# EAGLE design H_BRIDGE (EAGLE 5.06)
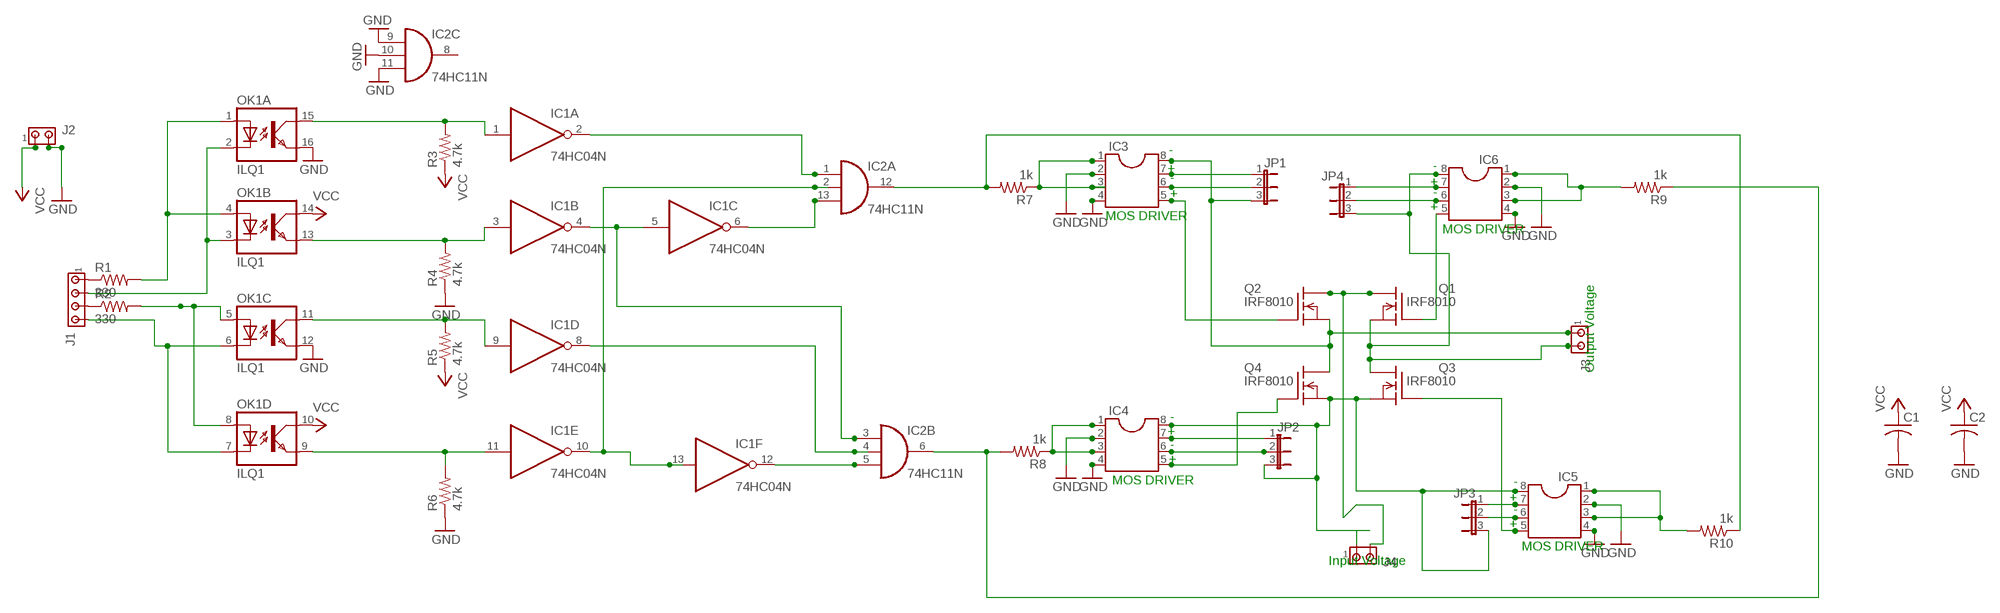
[diagram p0: schematic, sheet 1]

## Parts
C1  C-US025-030X050  [C025-030X050]
C2  C-US025-030X050  [C025-030X050]
IC1  74HC04N  [DIL14]
IC2  74HC11N  [DIL14]
IC3  DIL8  [DIL08]
IC4  DIL8  [DIL08]
IC5  DIL8  [DIL08]
IC6  DIL8  [DIL08]
J1  MTA04-100  [10X04MTA]
J2  MTA02-156  [1X2MTA]
J3  MTA02-156  [1X2MTA]
J4  MTA02-156  [1X2MTA]
JP1  JP2E  [JP2]
JP2  JP2E  [JP2]
JP3  JP2E  [JP2]
JP4  JP2E  [JP2]
OK1  ILQ1  [DIL16]
Q1  IRF8010  IRF840  [TO220]
Q2  IRF8010  IRF840  [TO220]
Q3  IRF8010  IRF840  [TO220]
Q4  IRF8010  IRF840  [TO220]
R1  330  R-US_0204/7  [0204/7]
R2  330  R-US_0204/7  [0204/7]
R3  4.7k  R-US_0204/7  [0204/7]
R4  4.7k  R-US_0204/7  [0204/7]
R5  4.7k  R-US_0204/7  [0204/7]
R6  4.7k  R-US_0204/7  [0204/7]
R7  1k  R-US_0204/7  [0204/7]
R8  1k  R-US_0204/7  [0204/7]
R9  1k  R-US_0204/7  [0204/7]
R10  1k  R-US_0204/7  [0204/7]

## Nets
GND: C1.2 C2.2 IC2.9(C:I0) IC2.10(C:I1) IC2.11(C:I2) IC3.2 IC3.4 IC4.2 IC4.4 IC5.2 IC5.4 IC6.2 IC6.4 J2.2 OK1.12(C:EMIT) OK1.16(A:EMIT) R4.1 R6.1
N$1: J1.1 R1.1
N$2: J1.3 R2.1
N$3: OK1.1(A:A) OK1.4(B:A) R1.2
N$4: J1.2 OK1.2(A:C) OK1.3(B:C)
N$5: OK1.5(C:A) OK1.8(D:A) R2.2
N$6: J1.4 OK1.6(C:C) OK1.7(D:C)
N$7: IC1.1(A:I) OK1.15(A:COL) R3.2
N$8: IC1.3(B:I) OK1.13(B:EMIT) R4.2
N$9: IC1.9(D:I) OK1.11(C:COL) R5.2
N$10: IC1.11(E:I) OK1.9(D:EMIT) R6.2
N$11: IC1.4(B:O) IC1.5(C:I) IC2.3(B:I0)
N$12: IC1.10(E:O) IC1.13(F:I) IC2.2(A:I1)
N$13: IC1.2(A:O) IC2.1(A:I0)
N$14: IC1.6(C:O) IC2.13(A:I2)
N$15: IC1.8(D:O) IC2.4(B:I1)
N$16: IC1.12(F:O) IC2.5(B:I2)
N$17: IC2.12(A:O) R7.2 R10.1
N$18: IC2.6(B:O) R8.2 R9.1
N$19: IC3.1 IC3.3 R7.1
N$20: IC5.1 IC5.3 R10.2
N$21: IC6.1 IC6.3 R9.2
N$22: IC4.1 IC4.3 R8.1
N$23: IC4.5 Q4.1(G)
N$24: IC5.5 Q3.1(G)
N$26: IC3.5 Q2.1(G)
N$27: IC4.6 JP2.2
N$28: IC4.7 JP2.1
N$29: IC3.6 JP1.2
N$30: IC3.7 JP1.1
N$31: IC6.6 JP4.2
N$32: IC6.7 JP4.1
N$33: IC5.6 JP3.2
N$34: IC5.7 JP3.1
N$35: IC4.8 IC5.8 J4.1 JP2.3 JP3.3 Q3.3(S) Q4.3(S)
N$36: IC6.8 J3.2 JP4.3 Q1.3(S) Q3.2(D)
N$39: J4.2 Q1.2(D) Q2.2(D)
N$40: IC3.8 J3.1 JP1.3 Q2.3(S) Q4.2(D)
N$42: IC6.5 Q1.1(G)
VCC: C1.1 C2.1 J2.1 OK1.10(D:COL) OK1.14(B:COL) R3.1 R5.1
Unconnected: IC2.8(C:O)

## Notes on the sheet
- -
- + | -
- -
- +
- + | -
- +
- MOS DRIVER
- MOS DRIVER
- Output Voltage
- -
- +
- -
- +
- MOS DRIVER | -
- +
- -
- +
- MOS DRIVER
- Input Voltage

## Power pins joined to a net without a drawn wire
GND: IC1.7(P:GND) IC2.7(P:GND)
VCC: IC1.14(P:VCC) IC2.14(P:VCC)

## Library data of the parts
C1 C2 = rcl:C-US: CAPACITOR, American symbol
IC1 = 74xx-eu:74*04: Hex INVERTER
IC2 = 74xx-eu:74*11: Triple 3-input AND gate
IC3-IC6 = ic-package:DIL8: Dual In Line / Socket
J1 = con-amp:MTA04-100: AMP connector
J2-J4 = con-amp:MTA02-156: AMP connector
JP1-JP4 = jumper:JP2E: JUMPER
OK1 = optocoupler:ILQ1: SIEMENS OPTO COUPLER
Q1-Q4 = transistor-fet:IRF840: N-Channel Enhancement MOSFET (HEXFET); 500V; 8A; 0,85Ohm
R1-R10 = rcl:R-US_: RESISTOR, American symbol

## Board
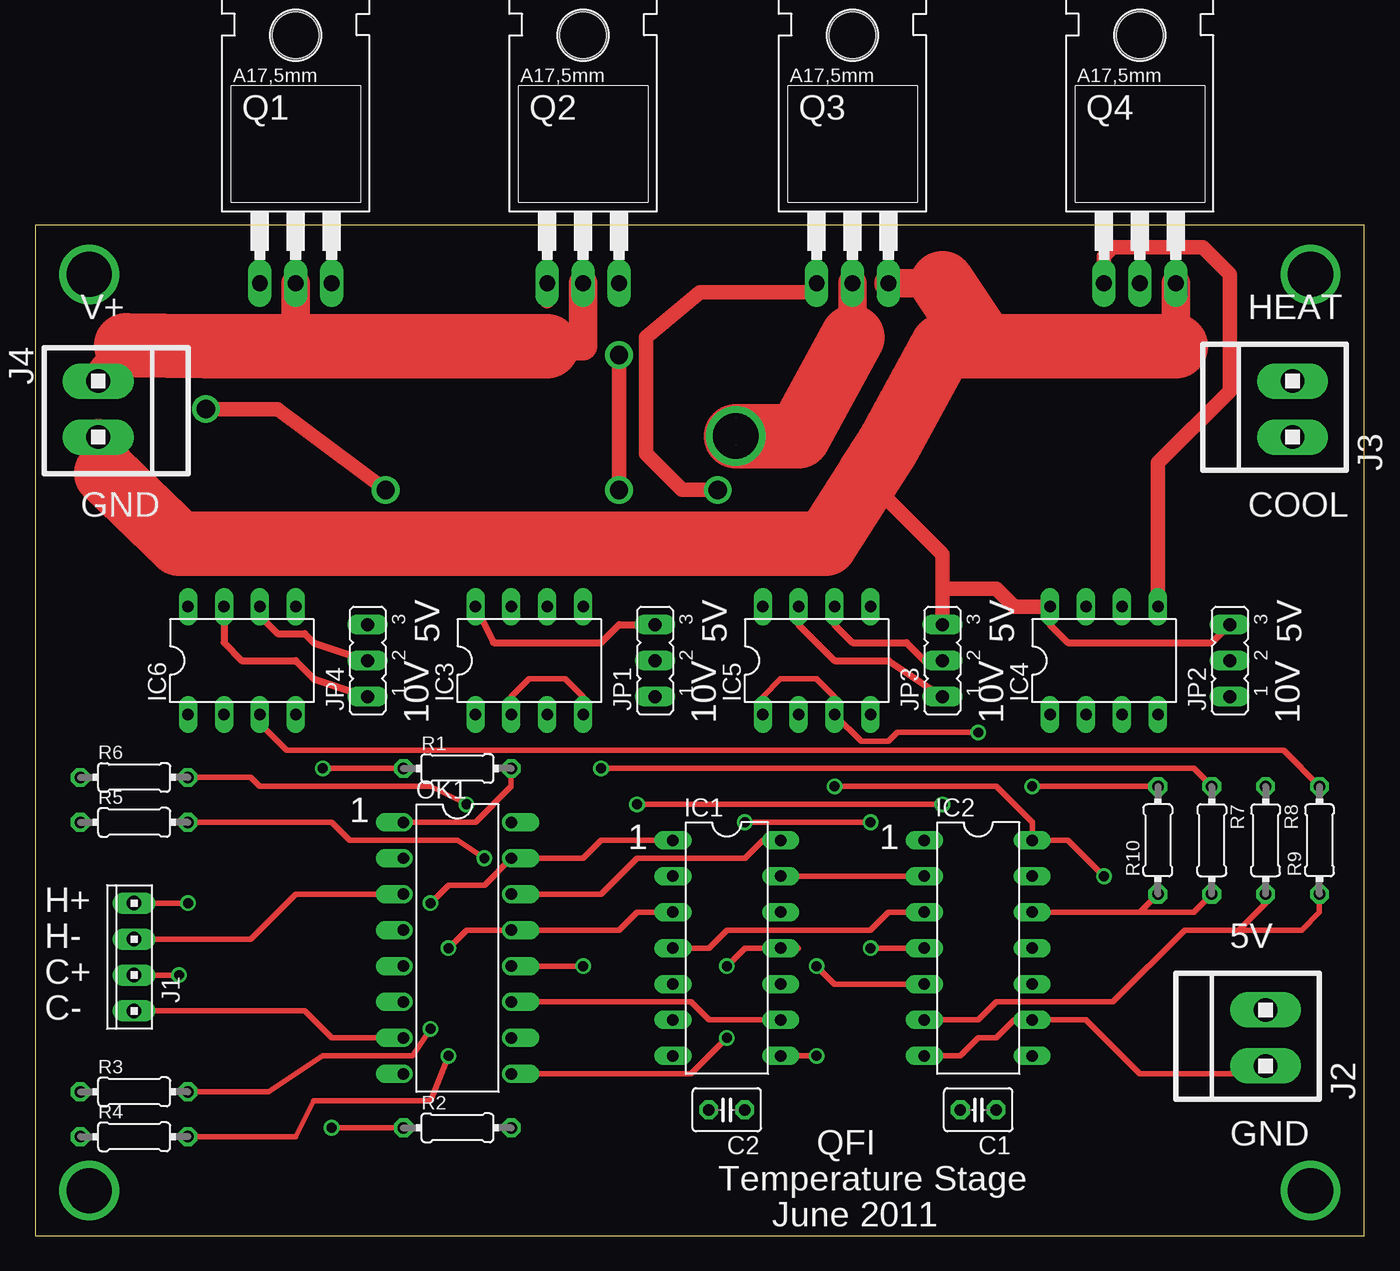
[diagram p1: board, top side]
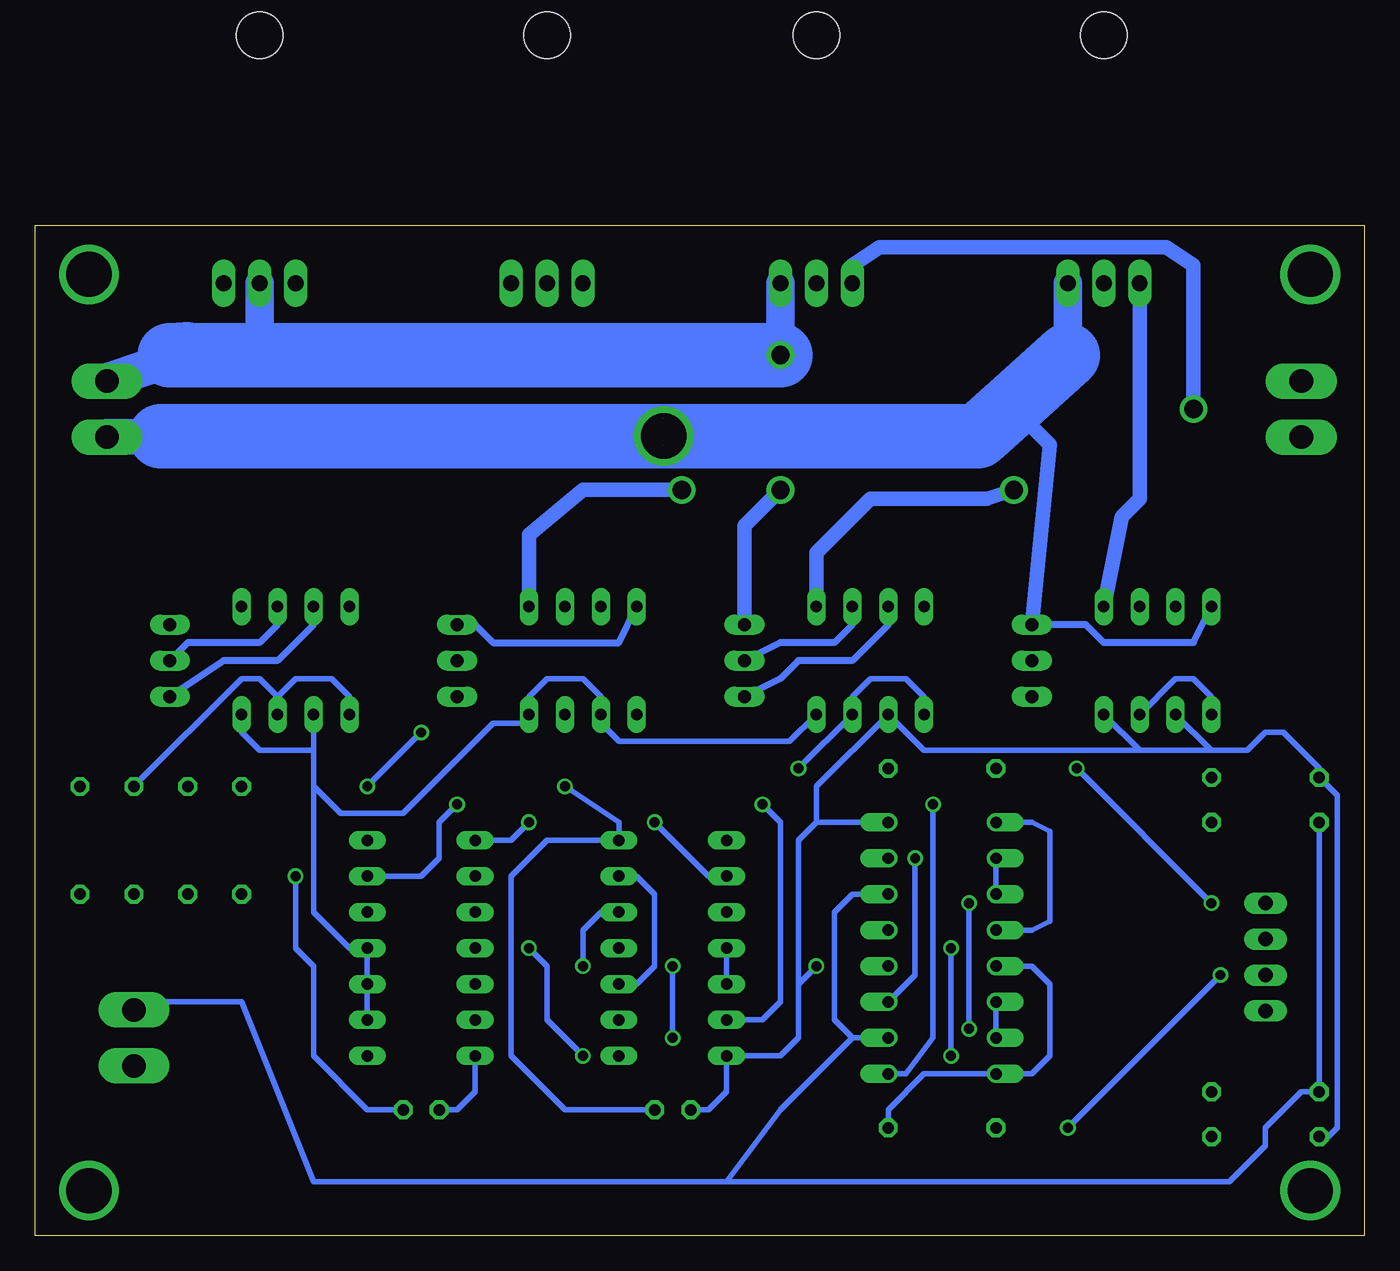
[diagram p2: board, bottom side, seen from below]

Size 93.96 x 71.42 mm. Coordinates in mm from the lower left corner, seen from the top.
Outline: 0,0 93.96,0 93.96,71.42 0,71.42 0,0
Copper layers (1*16): Top 0.035mm / dielectric 1.5mm / Bottom 0.035mm
Design rules "default": minimum track width 10mil, minimum drill 24mil, track to track 8mil, track to pad 8mil, pad to pad 8mil, via to via 8mil, smd to smd 8mil, copper to edge 40mil, drill to drill 8mil, minimum pad ring 10mil, minimum via ring 8mil, stop-mask expansion 4mil, vias tented up to drill 0mil, thermal gap 10mil

### Footprints (pad centres in the part's own frame; a part is rotated, then mirrored left to right if it is on the bottom)
C025-030X050 = drill 0.813 octagon: 1 -1.27,0; 2 1.27,0
DIL14 = drill 0.813 long: 1 -7.62,-3.81; 2 -5.08,-3.81; 3 -2.54,-3.81; 4 0,-3.81; 5 2.54,-3.81; 6 5.08,-3.81; 7 7.62,-3.81; 8 7.62,3.81; 9 5.08,3.81; 10 2.54,3.81; 11 0,3.81; 12 -2.54,3.81; 13 -5.08,3.81; 14 -7.62,3.81
DIL08 = drill 0.813 long: 1 -3.81,-3.81; 2 -1.27,-3.81; 3 1.27,-3.81; 4 3.81,-3.81; 5 3.81,3.81; 6 1.27,3.81; 7 -1.27,3.81; 8 -3.81,3.81
10X04MTA = drill 1.016 long: 1 3.81,0; 2 1.27,0; 3 -1.27,0; 4 -3.81,0
1X2MTA = drill 1.676 long: 1 1.981,0; 2 -1.981,0
JP2 = drill 0.914 long: 1 -2.54,0; 2 0,0; 3 2.54,0
DIL16 = drill 0.813 offset: 1 -8.89,-3.81; 2 -6.35,-3.81; 3 -3.81,-3.81; 4 -1.27,-3.81; 5 1.27,-3.81; 6 3.81,-3.81; 7 6.35,-3.81; 8 8.89,-3.81; 9 8.89,3.81; 10 6.35,3.81; 11 3.81,3.81; 12 1.27,3.81; 13 -1.27,3.81; 14 -3.81,3.81; 15 -6.35,3.81; 16 -8.89,3.81
TO220 = drill 1.118 long: 1 -2.54,-6.35; 2 0,-6.35; 3 2.54,-6.35 | hole 3.302: 0,11.176
0204/7 = drill 0.813 octagon: 1 -3.81,0; 2 3.81,0

### Placement (x,y rotation side)
C1  66.67,8.89 180 top
C2  48.9,8.89 180 top
IC1  48.9,20.32 270 top
IC2  66.67,20.32 270 top
IC3  34.93,40.64 0 top
IC4  75.56,40.64 0 top
IC5  55.25,40.64 0 top
IC6  14.61,40.64 0 top
J1  6.99,19.69 90 top
J2  86.99,13.97 90 top
J3  88.9,58.42 90 top
J4  4.45,58.42 270 top
JP1  43.82,40.64 90 top
JP2  84.45,40.64 90 top
JP3  64.13,40.64 90 top
JP4  23.49,40.64 90 top
OK1  29.84,20.32 270 top
Q1  18.41,73.66 0 top
Q2  38.73,73.66 0 top
Q3  57.79,73.66 0 top
Q4  78.1,73.66 0 top
R1  29.84,33.02 0 top
R2  29.84,7.62 0 top
R3  6.99,10.16 0 top
R4  6.99,6.98 0 top
R5  6.99,29.21 0 top
R6  6.99,32.39 0 top
R7  83.18,27.94 270 top
R8  86.99,27.94 270 top
R9  90.8,27.94 90 top
R10  79.38,27.94 90 top

### Tracks (layer width: path | path; a pad name or v marks a point on that pad's centre or on a via)
GND  (via drill 0.7)
  Top 0.406: v38.73,19.05 OK1.12 | IC2.7 65.41,12.7 66.67,13.97 67.94,13.97 69.21,15.24 IC2.9 74.3,15.24 78.1,11.43 86.44,11.43 J2.2 | IC3.4 38.73,38.1 37.47,39.37 34.93,39.37 33.66,38.1 IC3.2
  Bottom 0.406: R4.1 2.54,6.98 1.91,7.62 1.91,31.12 R6.1 3.17,33.02 5.71,35.56 6.99,35.56 8.26,34.29 10.79,34.29 | 40.01,17.78 v38.73,19.05 | 40.01,17.78 40.01,13.97 41.27,12.7 IC1.7 45.09,10.16 46.36,8.89 C2.2 | IC2.9 IC2.10 IC2.11 71.75,20.32 74.3,22.86 74.3,31.75 | 38.73,29.21 OK1.16 | 38.73,29.21 40.01,27.94 40.01,17.78 | 10.79,34.29 IC6.2 | 15.88,34.29 IC6.4 | 10.79,34.29 15.88,34.29 | 38.73,29.21 38.73,31.75 IC3.2 31.11,34.29 15.88,34.29 | IC3.4 40.64,34.93 52.71,34.93 53.98,36.2 IC5.2 53.98,38.1 55.25,39.37 57.79,39.37 59.05,38.1 IC5.4 59.69,36.2 61.59,36.2 67.94,29.84 72.39,29.84 74.3,31.75 | 74.3,31.75 74.3,34.29 | 74.3,34.29 IC4.2 | IC4.4 79.38,35.56 78.1,34.29 74.3,34.29 | C1.2 64.13,8.89 62.87,10.16 IC2.7
N$1  (via drill 0.7)
  Top 0.406: J1.1 v10.79,23.49 | v20.32,33.02 R1.1
  Bottom 0.406: v10.79,23.49 v20.32,33.02
N$2  (via drill 0.7)
  Top 0.406: J1.3 v10.16,18.41 | v20.95,7.62 R2.1
  Bottom 0.406: v10.16,18.41 v20.95,7.62
N$3
  Top 0.406: R1.2 33.66,31.75 31.11,29.21 OK1.1
  Bottom 0.406: OK1.1 23.49,29.21 22.22,28.58 22.22,22.23 23.49,21.59 OK1.4
N$4
  Top 0.406: J1.2 15.24,20.95 18.41,24.13 OK1.3
  Bottom 0.406: OK1.3 OK1.2
N$5
  Bottom 0.406: R2.2 33.66,8.89 31.11,11.43 OK1.8 23.49,11.43 22.22,12.7 22.22,17.78 23.49,19.05 OK1.5
N$6
  Top 0.406: J1.4 19.05,15.87 20.95,13.97 OK1.7
  Bottom 0.406: OK1.7 OK1.6
N$7  (via drill 0.7)
  Top 0.406: R3.2 16.51,10.16 20.32,12.7 26.67,12.7 v27.94,14.6 | v27.94,23.49 29.21,24.77 31.75,24.77 OK1.15 38.73,26.67 40.01,27.94 IC1.1
  Bottom 0.406: v27.94,14.6 v27.94,23.49
N$8  (via drill 0.7)
  Top 0.406: R4.2 18.41,6.98 19.68,9.53 27.94,9.53 v29.21,12.7 | v29.21,20.32 30.48,21.59 OK1.13 41.27,21.59 42.55,22.86 IC1.3
  Bottom 0.406: v29.21,12.7 v29.21,20.32
N$9  (via drill 0.7)
  Top 0.406: R5.2 20.95,29.21 22.22,27.94 29.84,27.94 v31.75,26.67 | 34.93,16.51 OK1.11 46.36,16.51 47.62,15.24 IC1.9
  Bottom 0.406: v31.75,26.67 31.75,18.41 OK1.11
N$10  (via drill 0.7)
  Top 0.406: R6.2 15.24,32.39 15.88,31.75 27.94,31.75 v30.48,30.48 | 34.93,11.43 OK1.9 46.36,11.43 v48.9,13.97 | v48.9,19.05 50.16,20.32 IC1.11 53.98,20.32
  Bottom 0.406: v30.48,30.48 30.48,13.97 32.39,11.43 OK1.9 | v48.9,13.97 v48.9,19.05
N$11
  Top 0.406: IC1.4 47.62,20.32 48.9,21.59 59.05,21.59 60.33,22.86 IC2.3
  Bottom 0.406: IC1.5 IC1.4
N$12
  Top 0.406: IC1.13 IC2.2
  Bottom 0.406: IC1.13 51.44,25.4 50.16,24.13 50.16,19.05 51.44,17.78 IC1.10
N$13  (via drill 0.7)
  Top 0.406: v50.16,29.21 v59.05,29.21
  Bottom 0.406: IC1.2 46.36,25.4 v50.16,29.21 | v59.05,29.21 60.33,27.94 IC2.1
N$14  (via drill 0.7)
  Top 0.406: v42.55,30.48 v64.13,30.48
  Bottom 0.406: IC1.6 42.55,15.24 41.27,16.51 41.27,29.21 v42.55,30.48 | v64.13,30.48 65.41,29.21 65.41,26.67 66.67,25.4 IC2.13
N$15  (via drill 0.7)
  Top 0.406: IC1.8 v55.25,12.7 | v59.05,20.32 IC2.4
  Bottom 0.406: v55.25,12.7 57.79,15.24 57.79,19.05 v59.05,20.32
N$16  (via drill 0.7)
  Top 0.406: v55.25,19.05 56.52,17.78 IC2.5
  Bottom 0.406: IC1.12 53.98,22.86 55.25,21.59 v55.25,19.05
N$17
  Top 0.406: IC2.12 78.1,22.86 | 78.1,22.86 81.91,22.86 R7.2 | 78.1,22.86 R10.1
N$18
  Top 0.406: IC2.6 66.67,15.24 67.94,16.51 76.2,16.51 81.28,21.59 83.18,21.59 | 83.18,21.59 85.09,21.59 86.99,23.49 R8.2 | R9.1 90.8,22.86 89.53,21.59 83.18,21.59
N$19  (via drill 0.7)
  Top 0.406: R7.1 81.91,33.02 v40.01,33.02
  Bottom 0.406: v40.01,33.02 IC3.3 36.2,38.1 34.93,39.37 32.39,39.37 31.11,38.1 IC3.1
N$20  (via drill 0.7)
  Top 0.406: v70.48,31.75 R10.2 | v66.67,35.56 60.96,35.56 60.33,34.93 58.42,34.93 IC5.3 56.52,38.1 55.25,39.37 52.71,39.37 51.44,38.1 IC5.1
  Bottom 0.406: v66.67,35.56 v70.48,31.75
N$21
  Top 0.406: IC6.3 15.88,36.2 17.78,34.29 88.27,34.29 R9.2
  Bottom 0.406: IC6.1 10.79,38.1 12.06,39.37 13.34,39.37 IC6.3
N$22
  Bottom 0.406: R8.1 79.38,39.37 78.1,39.37 76.83,38.1 | IC4.3 76.83,38.1 | 76.83,38.1 75.56,39.37 73.02,39.37 71.75,38.1 IC4.1
N$23
  Top 1.016: IC4.5 79.38,54.61 84.45,59.69 84.45,67.95 82.55,69.85 76.2,69.85 75.56,69.22 Q4.1
N$24  (via drill 1.3 pad 1.27)
  Top 1.016: v48.26,52.7 45.72,52.7 43.18,55.25 43.18,63.5 46.99,66.67 54.61,66.67 Q3.1
  Bottom 1.016: IC5.5 59.05,49.53 55.25,52.7 v48.26,52.7
N$25  (1 unrouted)
N$26  (via drill 1.3 pad 1.27)
  Top 1.016: v24.76,52.7 17.14,58.42 v12.06,58.42 | 36.2,66.04 Q2.1
  Bottom 1.016: IC3.5 38.73,48.26 34.93,52.07 26.67,52.07 v24.76,52.7 | v12.06,58.42 12.06,68.58 13.97,69.85 34.29,69.85 36.2,68.58 Q2.1
N$27
  Bottom 0.508: IC4.6 76.83,43.18 78.1,41.91 83.18,41.91 JP2.2
N$28
  Bottom 0.508: IC4.7 74.3,43.18 76.83,40.64 80.64,40.64 JP2.1
N$29
  Bottom 0.508: IC3.6 36.2,43.18 37.47,41.91 41.27,41.91 JP1.2
N$30
  Bottom 0.508: IC3.7 33.66,43.18 36.2,40.64 40.01,40.64 41.27,39.37 JP1.1
N$31
  Top 0.508: IC6.6 15.88,43.82 17.14,42.55 19.05,42.55 19.68,41.91 JP4.2
N$32
  Top 0.508: IC6.7 13.34,41.91 14.61,40.64 18.41,40.64 19.68,39.37 JP4.1
N$33
  Top 0.508: IC5.6 56.52,43.18 57.79,41.91 61.59,41.91 62.87,40.64 JP3.2
N$34
  Top 0.508: IC5.7 53.98,43.18 56.52,40.64 60.33,40.64 JP3.1
N$35
  Top 0.508: IC4.8 71.75,43.18 73.02,41.91 83.18,41.91 JP2.3
  Top 1.016: 64.13,45.72 64.13,48.17 58.81,53.5 | 64.13,45.72 JP3.3 | IC4.8 69.21,44.45 67.94,45.72 64.13,45.72
  Top 2.032: 80.64,62.86 Q4.3 | 64.13,67.31 Q3.3
  Top 2.54: 5,53.9 J4.1 | 66.67,62.86 66.67,63.5
  Top 4.572: 5,53.9 10.16,48.9 55.88,48.9 58.81,53.5 60.33,55.88 64.13,62.86 66.67,62.86 80.64,62.86 | 66.67,63.5 64.13,67.31
  Bottom 0.508: IC5.8 52.71,41.91 61.59,41.91 62.87,43.18 JP3.3
N$36  (via drill 3.2 pad 3.81)  (2 unrouted)
  Top 2.032: 57.79,63.5 Q3.2
  Top 4.572: 57.79,63.5 53.98,56.52 v49.53,56.52
  Bottom 0.508: IC6.8 12.06,41.91 18.41,41.91 19.68,43.18 JP4.3
  Bottom 1.016: JP4.3 22.22,55.9 24.95,58.63
  Bottom 2.032: 20.95,62.23 Q1.3
  Bottom 2.54: 84.45,56.52 J3.2
  Bottom 4.572: 85.09,56.52 84.45,56.52 53.98,56.52 v49.53,56.52 27.3,56.52 24.95,58.63 20.95,62.23
N$37  (4 unrouted)
N$38  (1 unrouted)
N$39
  Top 2.032: 36.2,62.86 38.73,62.86 Q2.2 | 18.41,62.86 Q1.2
  Top 2.54: J4.2 6.43,62.94
  Top 4.572: 6.43,62.94 12.06,62.86 18.41,62.86 36.2,62.86
N$40  (via drill 1.3 pad 1.27)
  Top 0.508: IC3.8 32.39,41.91 40.01,41.91 41.27,43.18 JP1.3
  Top 1.016: v41.27,52.7 v41.27,62.23
  Bottom 1.016: JP1.3 43.82,50.16 v41.27,52.7
  Bottom 2.032: v41.27,62.23 Q2.3 | 78.1,62.23 Q4.2
  Bottom 2.54: 83.26,62.31 J3.1
  Bottom 4.572: 83.26,62.31 84.45,62.23 78.1,62.23 v41.27,62.23
N$42
  Bottom 1.016: Q1.1 15.88,52.07 17.14,50.8 IC6.5
N$44  (via drill 3.2)
  other vias: 3.81,67.95
N$45  (via drill 3.2)
  other vias: 90.17,67.95
N$46  (via drill 3.2)
  other vias: 90.17,3.18
N$48  (via drill 3.2)
  other vias: 3.81,3.18
VCC  (via drill 0.7)
  Top 0.406: OK1.14 40.01,24.13 42.55,26.67 50.16,26.67 51.44,27.94 IC1.14 | v56.52,31.75 67.94,31.75 70.48,29.21 IC2.14 73.02,27.94 v75.56,25.4
  Bottom 0.406: R5.1 R3.1 4.45,10.16 6.99,7.62 6.99,6.35 9.53,3.81 45.09,3.81 | v56.52,31.75 52.71,29.21 IC1.14 57.79,27.94 60.33,25.4 60.33,12.7 56.52,8.89 C2.1 | 36.2,13.97 41.27,8.89 45.09,3.81 | 45.09,3.81 74.3,3.81 79.38,16.51 86.44,16.51 J2.1 | 36.2,13.97 OK1.10 | 36.2,13.97 37.47,15.24 37.47,22.86 36.2,24.13 OK1.14 | C1.1 70.48,8.89 74.3,12.7 74.3,19.05 75.56,20.32 v75.56,25.4

### Text on the board
tNames: V+ | HEAT | GND | COOL | 5V | 5V | 5V | 5V | 10V | 10V | 10V | 10V | 1 | 1 | 1 | H+ | H- | 5V | C+ | C- | QFI | GND | Temperature Stage | June 2011